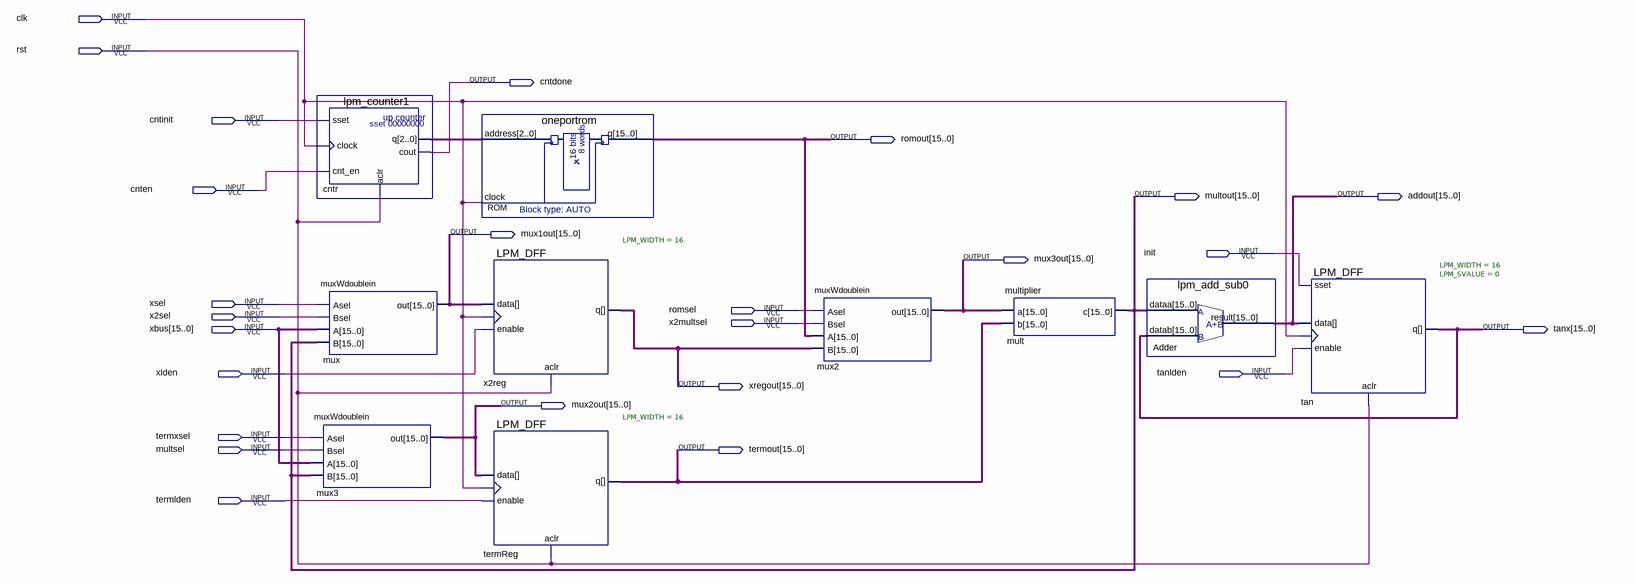
[diagram p0: schematic sheet]
// Quartus schematic datapath.bdf as structural Verilog: 10 symbols, 25 pins
module datapath (
  input  clk,
  input  rst,
  input  cntinit,
  input  cnten,
  input  init,
  input  xsel,
  input  romsel,
  input  x2sel,
  input  x2multsel,
  input  [15:0] xbus,
  input  xlden,
  input  tanlden,
  input  termxsel,
  input  multsel,
  input  termlden,
  output cntdone,
  output [15:0] romout,
  output [15:0] multout,
  output [15:0] addout,
  output [15:0] mux1out,
  output [15:0] mux3out,
  output [15:0] tanx,
  output [15:0] xregout,
  output [15:0] mux2out,
  output [15:0] termout
);

  wire [2:0] cntr_q;

  lpm_counter1 cntr (.sset(cntinit), .clock(clk), .cnt_en(cnten), .aclr(rst), .cout(cntdone), .q(cntr_q));
  muxWdoublein mux (.Asel(xsel), .Bsel(x2sel), .A(xbus), .B(multout), .out(mux1out));
  muxWdoublein mux3 (.Asel(termxsel), .Bsel(multsel), .A(xbus), .B(multout), .out(mux2out));
  oneportrom ROM (.address(cntr_q), .clock(clk), .q(romout));
  LPM_DFF #(.LPM_WIDTH(16)) x2reg (.aclr(rst), .clock(clk), .data(mux1out), .enable(xlden), .q(xregout));
  LPM_DFF #(.LPM_WIDTH(16)) termReg (.aclr(rst), .clock(clk), .data(mux2out), .enable(termlden), .q(termout));
  muxWdoublein mux2 (.Asel(romsel), .Bsel(x2multsel), .A(romout), .B(xregout), .out(mux3out));
  multiplier mult (.a(mux3out), .b(termout), .c(multout));
  lpm_add_sub0 Adder (.dataa(multout), .datab(tanx), .result(addout));
  LPM_DFF #(.LPM_WIDTH(16), .LPM_SVALUE(0)) tan (
    .aclr(rst), .clock(clk), .data(addout), .enable(tanlden), .sset(init), .q(tanx));
endmodule
